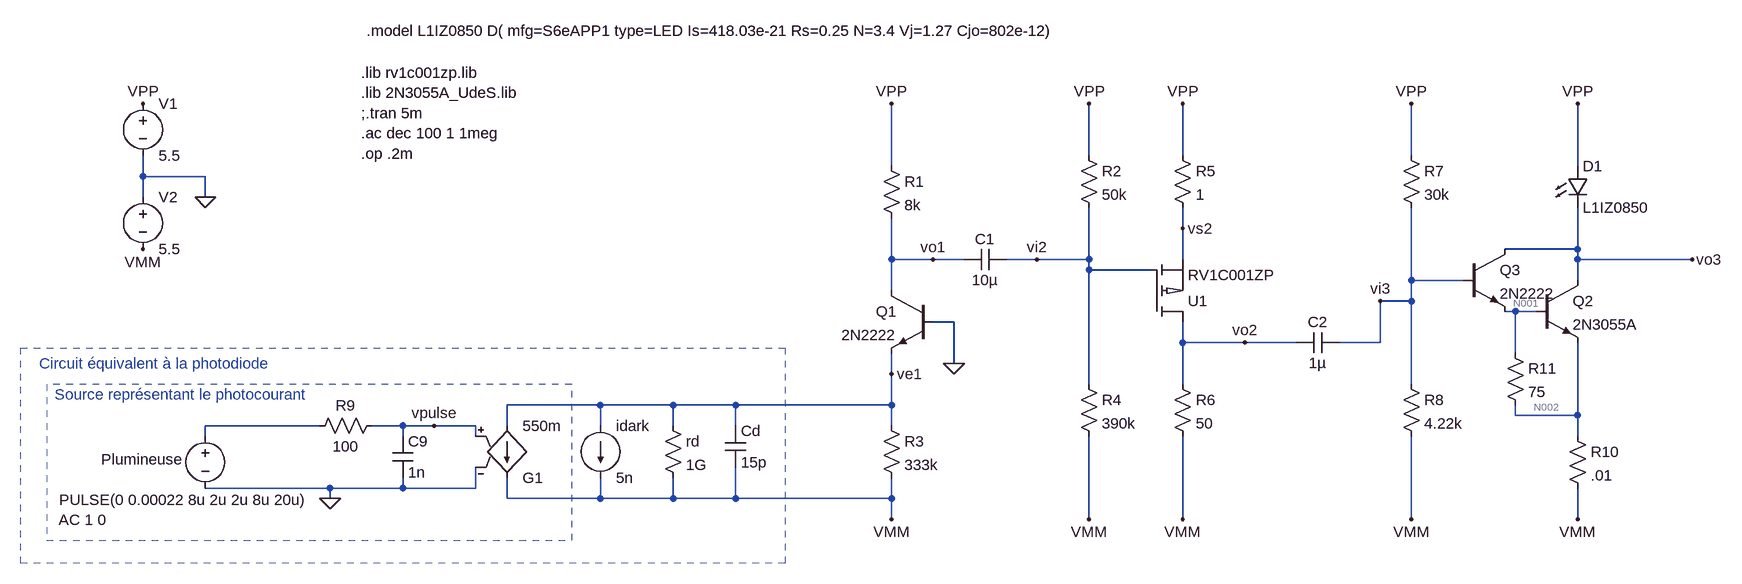
[diagram p0: schematic S6eAPP1_probl_initiale_2025.asc]
S6eAPP1_probl_initiale_2025.asc, the LTspice schematic file:
Version 4
SHEET 1 2260 1556
WIRE 480 32 480 -48
WIRE 624 32 624 -48
WIRE 976 32 976 -48
WIRE 176 48 176 -48
WIRE 1232 48 1232 -48
WIRE -976 64 -976 32
WIRE -880 64 -976 64
WIRE -976 96 -976 64
WIRE -880 96 -880 64
WIRE 624 144 624 112
WIRE 1232 176 1232 112
WIRE 1232 176 1120 176
WIRE 176 192 176 128
WIRE 240 192 176 192
WIRE 288 192 240 192
WIRE 400 192 352 192
WIRE 480 192 480 112
WIRE 480 192 400 192
WIRE 624 192 624 144
WIRE 1232 192 1232 176
WIRE 1408 192 1232 192
WIRE 480 208 480 192
WIRE 576 208 480 208
WIRE 976 224 976 112
WIRE 1056 224 976 224
WIRE 1232 224 1232 192
WIRE 176 240 176 192
WIRE 976 256 976 224
WIRE 976 256 928 256
WIRE 1136 272 1120 272
WIRE 1168 272 1136 272
WIRE 272 288 240 288
WIRE 624 320 624 288
WIRE 720 320 624 320
WIRE 800 320 720 320
WIRE 928 320 928 256
WIRE 928 320 864 320
WIRE 1136 336 1136 272
WIRE 272 352 272 288
WIRE 176 368 176 336
WIRE 480 384 480 208
WIRE 624 384 624 320
WIRE 976 384 976 256
WIRE -272 416 -416 416
WIRE -160 416 -272 416
WIRE -64 416 -160 416
WIRE 176 416 176 368
WIRE 176 416 -64 416
WIRE 1136 432 1136 416
WIRE 1232 432 1232 320
WIRE 1232 432 1136 432
WIRE -704 448 -880 448
WIRE -576 448 -624 448
WIRE -528 448 -576 448
WIRE -464 448 -528 448
WIRE -416 448 -416 416
WIRE -272 448 -272 416
WIRE -160 448 -160 416
WIRE -64 448 -64 416
WIRE 176 448 176 416
WIRE -880 464 -880 448
WIRE -576 464 -576 448
WIRE -464 464 -464 448
WIRE 1232 464 1232 432
WIRE -688 544 -880 544
WIRE -576 544 -576 528
WIRE -576 544 -688 544
WIRE -464 544 -464 512
WIRE -464 544 -576 544
WIRE -688 560 -688 544
WIRE -416 560 -416 528
WIRE -272 560 -272 528
WIRE -272 560 -416 560
WIRE -160 560 -160 528
WIRE -160 560 -272 560
WIRE -64 560 -64 512
WIRE -64 560 -160 560
WIRE 176 560 176 528
WIRE 176 560 -64 560
WIRE 176 592 176 560
WIRE 480 592 480 464
WIRE 624 592 624 464
WIRE 976 592 976 464
WIRE 1232 592 1232 544
FLAG 272 352 0
FLAG 176 -48 VPP
FLAG -976 -48 VPP
FLAG -976 176 VMM
FLAG -880 96 0
FLAG 176 592 VMM
FLAG 240 192 vo1
FLAG 176 368 ve1
FLAG 480 -48 VPP
FLAG 480 592 VMM
FLAG 624 -48 VPP
FLAG 624 592 VMM
FLAG 400 192 vi2
FLAG 720 320 vo2
FLAG 624 144 vs2
FLAG 976 -48 VPP
FLAG 976 592 VMM
FLAG 1232 -48 VPP
FLAG 1232 592 VMM
FLAG 928 256 vi3
FLAG 1408 192 vo3
FLAG -688 560 0
FLAG -528 448 vpulse
SYMBOL /npn 240 240 M0
SYMATTR InstName Q1
SYMATTR Value 2N2222
SYMBOL /res 160 32 R0
SYMATTR InstName R1
SYMATTR Value 8k
SYMBOL /voltage -976 -64 R0
SYMATTR InstName V1
SYMATTR Value 5.5
SYMBOL /res 160 432 R0
SYMATTR InstName R3
SYMATTR Value 333k
SYMBOL /voltage -976 80 R0
SYMATTR InstName V2
SYMATTR Value 5.5
SYMBOL /current -272 448 R0
SYMATTR InstName idark
SYMATTR Value 5n
SYMBOL /res -176 432 R0
SYMATTR InstName rd
SYMATTR Value 1G
SYMBOL /res 464 16 R0
SYMATTR InstName R2
SYMATTR Value 50k
SYMBOL /res 464 368 R0
SYMATTR InstName R4
SYMATTR Value 390k
SYMBOL /res 608 16 R0
SYMATTR InstName R5
SYMATTR Value 1
SYMBOL /res 608 368 R0
SYMATTR InstName R6
SYMATTR Value 50
SYMBOL /cap 352 176 R90
WINDOW 0 0 32 VBottom 2
WINDOW 3 32 32 VTop 2
SYMATTR InstName C1
SYMATTR Value 10µ
SYMBOL /res 960 16 R0
SYMATTR InstName R7
SYMATTR Value 30k
SYMBOL /res 960 368 R0
SYMATTR InstName R8
SYMATTR Value 4.22k
SYMBOL /res 1216 448 R0
SYMATTR InstName R10
SYMATTR Value .01
SYMBOL /cap -80 448 R0
SYMATTR InstName Cd
SYMATTR Value 15p
SYMBOL LED 1216 48 R0
SYMATTR InstName D1
SYMATTR Value L1IZ0850
SYMBOL npn 1168 224 R0
SYMATTR InstName Q2
SYMATTR Value 2N3055A
SYMBOL /npn 1056 176 R0
SYMATTR InstName Q3
SYMATTR Value 2N2222
SYMBOL /cap 864 304 R90
WINDOW 0 0 32 VBottom 2
WINDOW 3 32 32 VTop 2
SYMATTR InstName C2
SYMATTR Value 1µ
SYMBOL g2 -416 544 M180
SYMATTR InstName G1
SYMATTR Value 550m
SYMBOL res -608 432 R90
WINDOW 0 0 56 VBottom 2
WINDOW 3 32 56 VTop 2
SYMATTR InstName R9
SYMATTR Value 100
SYMBOL cap -592 464 R0
SYMATTR InstName C9
SYMATTR Value 1n
SYMBOL voltage -880 448 R0
WINDOW 3 -225 114 Left 2
WINDOW 123 -226 145 Left 2
WINDOW 39 0 0 Left 0
WINDOW 0 -160 52 Left 2
SYMATTR Value PULSE(0 0.00022 8u 2u 2u 8u 20u)
SYMATTR Value2 AC 1 0
SYMATTR InstName Plumineuse
SYMBOL res 1120 320 R0
SYMATTR InstName R11
SYMATTR Value 75
SYMBOL pmos_RV1C001 576 288 M180
SYMATTR InstName U1
TEXT -640 -96 Left 2 !.lib rv1c001zp.lib\n.lib 2N3055A_UdeS.lib\n;.tran 5m\n.ac dec 100 1 1meg\n.op .2m
TEXT -1112 400 Left 2 ;Source représentant le photocourant
TEXT -1136 352 Left 2 ;Circuit équivalent à la photodiode
TEXT -632 -160 Left 2 !.model L1IZ0850 D( mfg=S6eAPP1 type=LED Is=418.03e-21 Rs=0.25 N=3.4 Vj=1.27 Cjo=802e-12)
RECTANGLE Normal -1124 624 -316 384 1
RECTANGLE Normal -1164 328 12 660 1

The netlist it stands for:
* S6eAPP1_probl_initiale_2025.asc
Q1 vo1 0 ve1 0 2N2222
R1 VPP vo1 8k
V1 VPP 0 5.5
R3 ve1 VMM 333k
V2 0 VMM 5.5
idark ve1 VMM 5n
rd ve1 VMM 1G
R2 VPP vi2 50k
R4 vi2 VMM 390k
R5 VPP vs2 1
R6 vo2 VMM 50
C1 vi2 vo1 10µ
R7 VPP vi3 30k
R8 vi3 VMM 4.22k
R10 N002 VMM .01
Cd ve1 VMM 15p
D1 VPP vo3 L1IZ0850
Q2 vo3 N001 N002 0 2N3055A
Q3 vo3 vi3 N001 0 2N2222
C2 vi3 vo2 1µ
G1 ve1 VMM vpulse 0 550m
R9 vpulse N003 100
C9 vpulse 0 1n
V§Plumineuse N003 0 PULSE(0 0.00022 8u 2u 2u 8u 20u) AC 1 0
R11 N001 N002 75
XU1 vo2 vi2 vs2 RV1C001ZP  ; pins D G S
.model D D
.lib standard.dio
.model NPN NPN
.model PNP PNP
.lib standard.bjt
.lib rv1c001zp.lib
.lib 2N3055A_UdeS.lib
;.tran 5m
.ac dec 100 1 1meg
.op .2m
* Source représentant le photocourant
* Circuit équivalent à la photodiode
.model L1IZ0850 D( mfg=S6eAPP1 type=LED Is=418.03e-21 Rs=0.25 N=3.4 Vj=1.27 Cjo=802e-12)
.backanno
.end

* Results of the author's LTspice run, read from the files saved beside the schematic
* Operating Point, zero values left out:
*   V(vo1) = 5.381 V
*   V(ve1) = -544.8 mV
*   V(vpp) = 5.5 V
*   V(vmm) = -5.5 V
*   V(vi2) = 4.25 V
*   V(vs2) = 5.471 V
*   V(vo2) = -4.065 V
*   V(vi3) = -4.268 V
*   V(n002) = -5.5 V
*   V(vo3) = 2.177 V
*   V(n001) = -4.975 V
*   Ic(Q1) = 14.82 µA
*   Ib(Q1) = 70.31 nA
*   Ie(Q1) = -14.89 µA
*   Ic(Q3) = 7.037 mA
*   Ib(Q3) = 33.78 µA
*   Ie(Q3) = -7.07 mA
*   Ic(Q2) = 3.434 mA
*   Ib(Q2) = 68.55 µA
*   Ie(Q2) = -3.503 mA
*   I(D1) = 10.47 mA
*   I(Idark) = 5 nA
*   I(R1) = 14.82 µA
*   I(R3) = 14.88 µA
*   I(Rd) = 4.955 nA
*   I(R2) = 25 µA
*   I(R4) = 25 µA
*   I(R5) = 28.7 mA
*   I(R6) = 28.7 mA
*   I(R7) = 325.6 µA
*   I(R8) = 291.8 µA
*   I(R10) = 10.5 mA
*   I(R11) = 7.002 mA
*   I(V1) = -39.54 mA
*   I(V2) = -39.54 mA
*   Ix(u1:1) = -28.7 mA
*   Ix(u1:2) = 8.266 pA
*   Ix(u1:3) = 28.7 mA
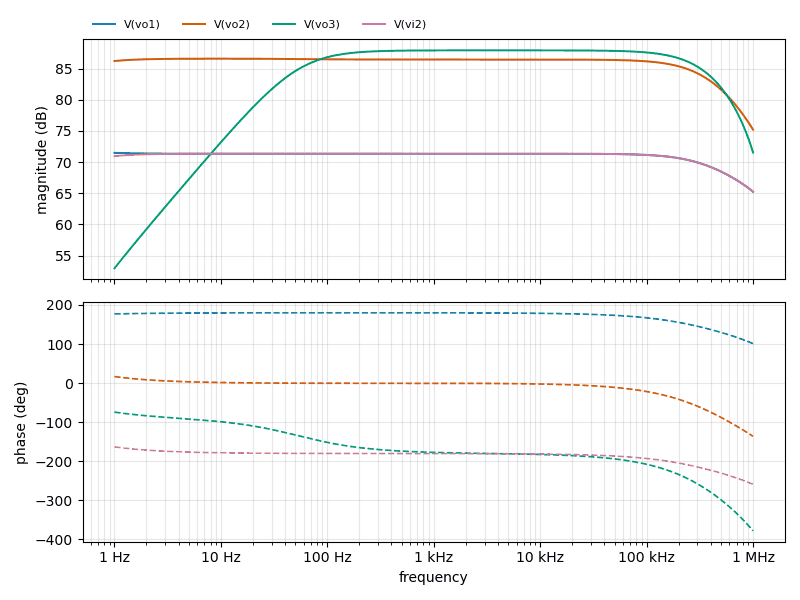
[diagram p1: AC Analysis of S6eAPP1_probl_initiale_2025.asc, plotted from the saved traces]
* AC Analysis, 1 run:
*   V(vo1): 71.48 dB at 1 Hz, 65.25 dB at 1 MHz, peak 71.48 dB at 1 Hz, 3 dB below the peak at 500.5 kHz
*   V(vo2): 86.21 dB at 1 Hz, 75.20 dB at 1 MHz, peak 86.59 dB at 9.772 Hz, 3 dB below the peak at 353 kHz
*   V(vo3): 52.95 dB at 1 Hz, 71.54 dB at 1 MHz, peak 87.93 dB at 4.365 kHz, 3 dB below the peak at 53.64 Hz and 325.8 kHz
*   V(vi2): 70.96 dB at 1 Hz, 65.25 dB at 1 MHz, peak 71.34 dB at 371.5 Hz, 3 dB below the peak at 520.6 kHz
* From the log:
*   Semiconductor Device Operating Points:
*                           --- Diodes ---
*   Name:      d1        d:u1:1      d:u1:2
*   Model:  l1iz0850     u1:dds      u1:ddg
*   Id:      1.05e-02   -1.75e-11   -8.27e-12
*   Vd:      3.32e+00   -9.54e+00   -8.27e+00
*   Req:     8.40e+00    1.00e+12    1.00e+12
*   CAP:     3.53e-09    2.54e-12    5.40e-13
*                           --- Bipolar Transistors ---
*   Name:       q1          q3          q2
*   Model:    2n2222      2n2222      2n3055a
*   Ib:       7.03e-08    3.38e-05    6.85e-05
*   Ic:       1.48e-05    7.04e-03    3.43e-03
*   Vbe:      5.45e-01    7.06e-01    5.25e-01
*   Vbc:     -5.38e+00   -6.45e+00   -7.15e+00
*   Vce:      5.93e+00    7.15e+00    7.68e+00
*   BetaDC:   2.11e+02    2.08e+02    5.01e+01
*   Gm:       5.73e-04    2.66e-01    1.31e-01
*   Rpi:      3.68e+05    7.66e+02    4.30e+02
*   Rx:       1.00e+01    1.00e+01    2.69e+00
*   Ro:       7.11e+06    1.51e+04    1.66e+04
*   Cbe:      3.64e-11    1.47e-10    1.12e-08
*   Cbc:      4.00e-12    3.79e-12    8.27e-11
*   Cjs:      0.00e+00    0.00e+00    0.00e+00
*   BetaAC:   2.11e+02    2.04e+02    5.64e+01
*   Cbx:      0.00e+00    0.00e+00    0.00e+00
*   Ft:       2.26e+06    2.81e+08    1.84e+06
*                           --- MOSFET Transistors ---
*   Name:        m:u1:1
*   Model:      u1:mos_p
*   Id:         -2.87e-02
*   Vgs:        -1.22e+00
*   Vds:        -9.49e+00
*   Vbs:         0.00e+00
*   Vth:        -8.54e-01
*   Vdsat:      -3.83e-01
*   Gm:          1.37e-01
*   Gds:         8.07e-04
*   Gmb:         2.44e-02
*   Cbd:         0.00e+00
*   Cbs:         0.00e+00
*   Cgsov:       1.00e-11
*   Cgdov:       1.00e-12
*   Cgbov:       0.00e+00
*   Cgs:         2.30e-12
*   Cgd:         0.00e+00
*   Cgb:         0.00e+00